# EAGLE design dual_usb (EAGLE 4.16)
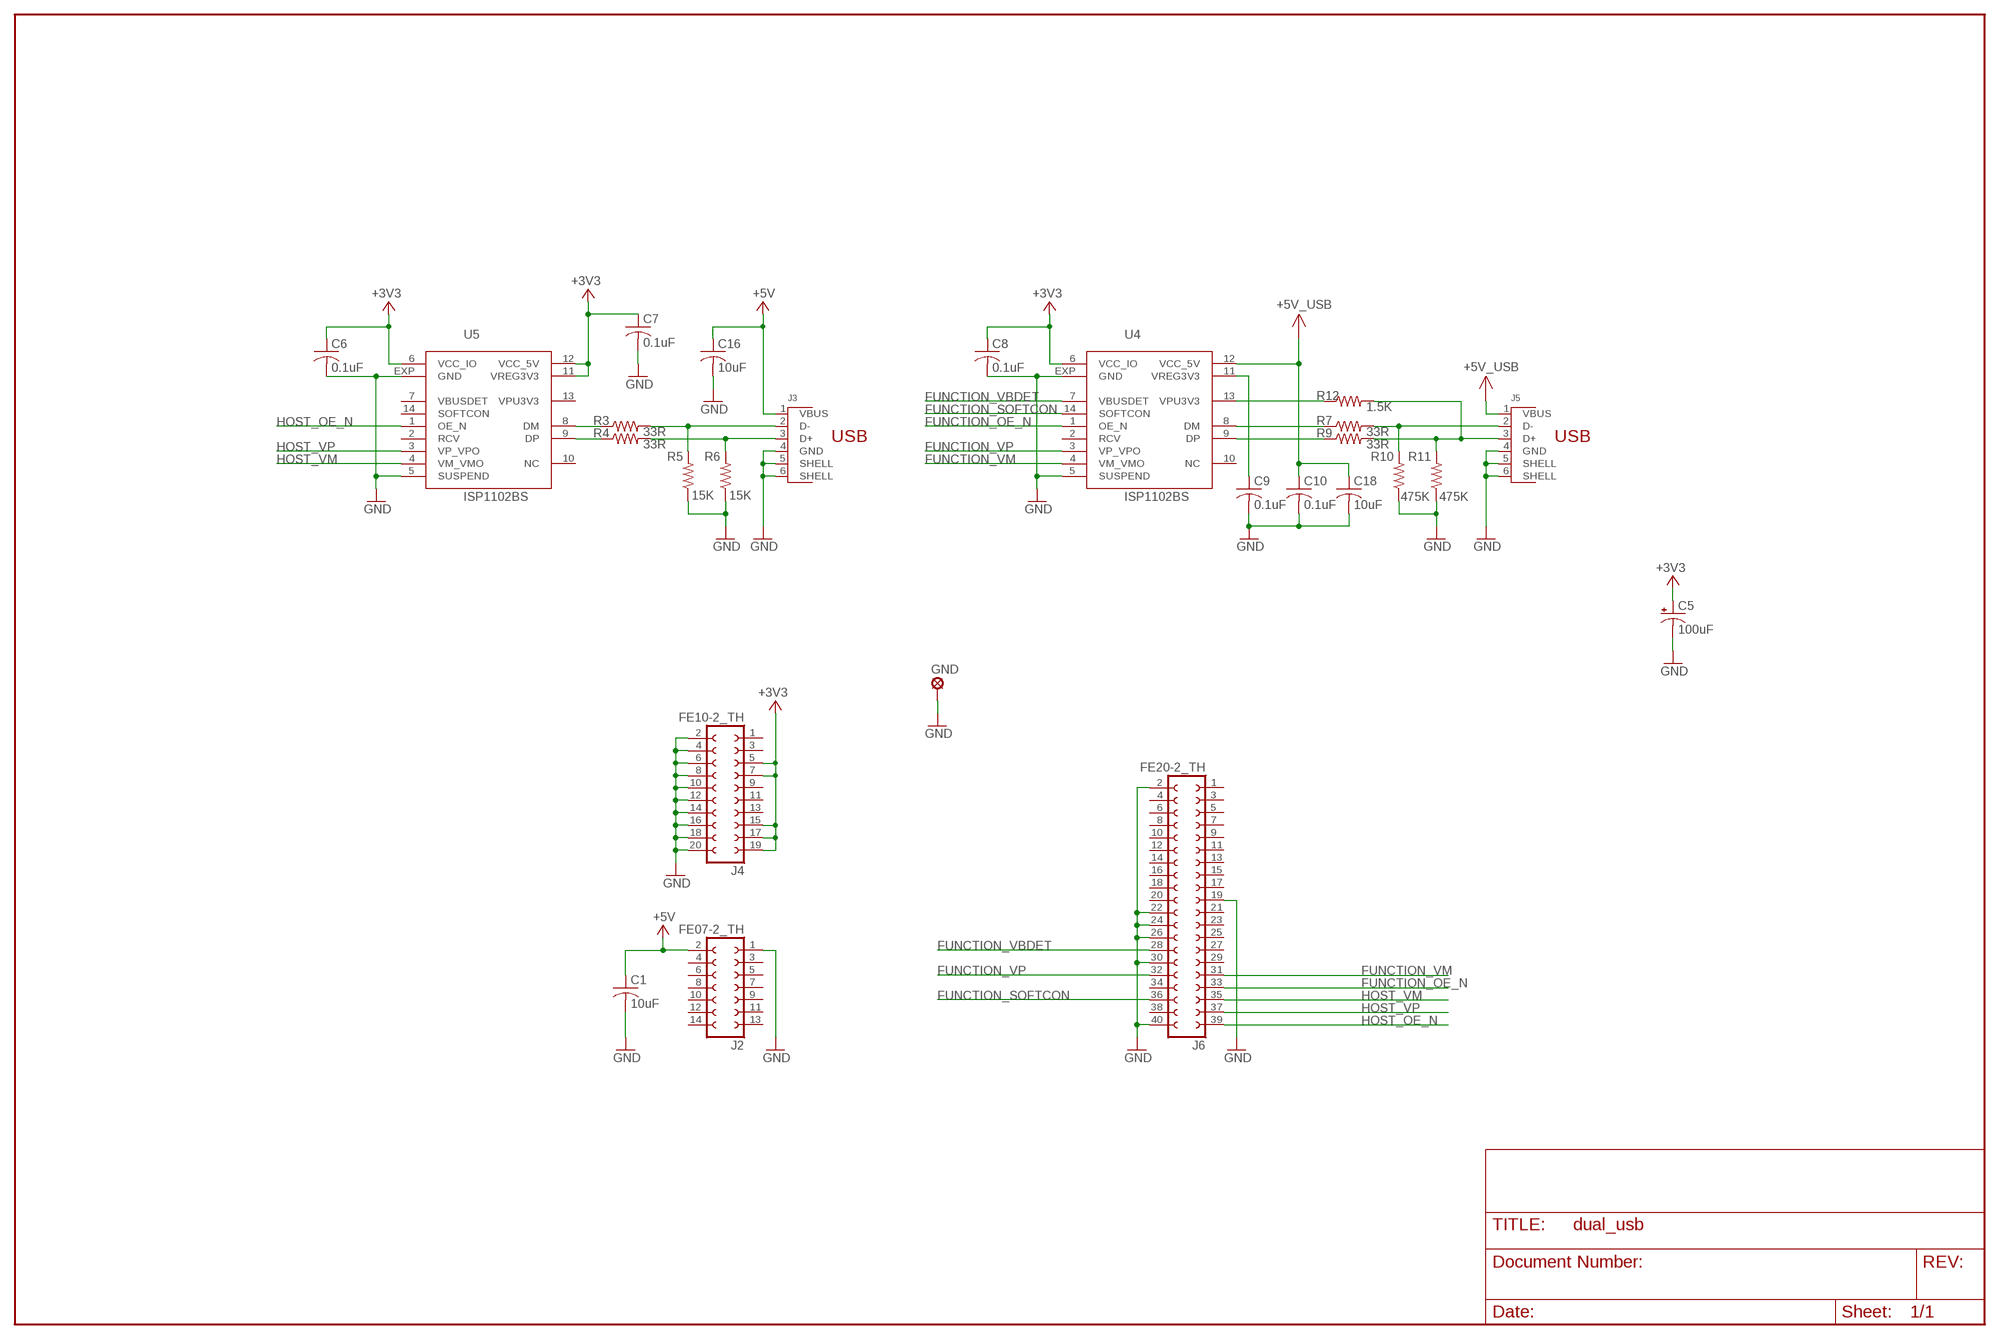
[diagram p0: schematic, sheet 1]

## Parts
C1  10uF  C-USC0603  [C0603]
C5  100uF  CPOL-USCT3528  [CT3528]
C6  0.1uF  C-USC0603  [C0603]
C7  0.1uF  C-USC0603  [C0603]
C8  0.1uF  C-USC0603  [C0603]
C9  0.1uF  C-USC0603  [C0603]
C10  0.1uF  C-USC0603  [C0603]
C16  10uF  C-USC0603  [C0603]
C18  10uF  C-USC0603  [C0603]
GND  LSP10  [LSP10]
J2  FE07-2_TH  [FE07-2_TH]
J3  PN87520  [PN87520]
J4  FE10-2_TH  [FE10-2_TH]
J5  897-43-004-90-000000  [USB-B-PTH]
J6  FE20-2_TH  [FE20-2_TH]
R3  33R  R-US_R0603  [R0603]
R4  33R  R-US_R0603  [R0603]
R5  15K  R-US_R0603  [R0603]
R6  15K  R-US_R0603  [R0603]
R7  33R  R-US_R0603  [R0603]
R9  33R  R-US_R0603  [R0603]
R10  475K  R-US_R0603  [R0603]
R11  475K  R-US_R0603  [R0603]
R12  1.5K  R-US_R0603  [R0603]
U4  ISP1102BS  [HVQFN14]
U5  ISP1102BS  [HVQFN14]

## Nets
+3V3: C5.+ C6.1 C7.1 C8.1 J4.5 J4.7 J4.15 J4.17 J4.19 U4.6(VCC_IO) U5.6(VCC_IO) U5.11(VREG3V3) U5.12(VCC_5V)
+5V: C1.1 C16.1 J2.2 J3.1(VBUS)
+5V_USB: C10.1 C18.1 J5.1(VBUS) U4.12(VCC_5V)
FUNCTION_OE_N: J6.33 U4.1(OE_N)
FUNCTION_SOFTCON: J6.36 U4.14(SOFTCON)
FUNCTION_VBDET: J6.28 U4.7(VBUSDET)
FUNCTION_VM: J6.31 U4.4(VM_VMO)
FUNCTION_VP: J6.32 U4.3(VP_VPO)
GND: C1.2 C5.- C6.2 C7.2 C8.2 C9.2 C10.2 C16.2 C18.2 GND.MP J2.1 J3.4(GND) J3.5(SHELL) J3.6(SHELL) J4.2 J4.4 J4.6 J4.8 J4.10 J4.12 J4.14 J4.16 J4.18 J4.20 J5.4(GND) J5.5(SHELL) J5.6(SHELL) J6.2 J6.19 J6.22 J6.24 J6.26 J6.30 J6.40 R5.1 R6.1 R10.1 R11.1 U4.5(SUSPEND) U4.EXP(GND) U5.5(SUSPEND) U5.EXP(GND)
HOST_OE_N: J6.39 U5.1(OE_N)
HOST_VM: J6.35 U5.4(VM_VMO)
HOST_VP: J6.37 U5.3(VP_VPO)
N$2: R3.1 U5.8(DM)
N$3: R4.1 U5.9(DP)
N$4: R7.1 U4.8(DM)
N$5: J3.2(D-) R3.2 R5.2
N$13: C9.1 U4.11(VREG3V3)
N$14: J3.3(D+) R4.2 R6.2
N$15: R9.1 U4.9(DP)
N$33: J5.2(D-) R7.2 R10.2
N$45: R12.1 U4.13(VPU3V3)
N$46: J5.3(D+) R9.2 R11.2 R12.2
Unconnected: J2.3 J2.4 J2.5 J2.6 J2.7 J2.8 J2.9 J2.10 J2.11 J2.12 J2.13 J2.14 J4.1 J4.3 J4.9 J4.11 J4.13 J6.1 J6.3 J6.4 J6.5 J6.6 J6.7 J6.8 J6.9 J6.10 J6.11 J6.12 J6.13 J6.14 J6.15 J6.16 J6.17 J6.18 J6.20 J6.21 J6.23 J6.25 J6.27 J6.29 J6.34 J6.38 U4.2(RCV) U4.10(NC) U5.2(RCV) U5.7(VBUSDET) U5.10(NC) U5.13(VPU3V3) U5.14(SOFTCON)

## Library data of the parts
C1 C6-C10 C16 C18 = rcl:C-US: CAPACITOR, American symbol
C5 = rcl:CPOL-US: POLARIZED CAPACITOR, American symbol
GND = solpad:LSP10: SOLDER PAD drill 1.0 mm, distributor Buerklin, 12H555
J2 = base2designs:FE07-2_TH
J3 = base2designs:PN87520: BERG USB connector
J4 = base2designs:FE10-2_TH
J5 = base2designs:897-43-004-90-000000
J6 = base2designs:FE20-2_TH
R3-R7 R9-R12 = rcl:R-US_: RESISTOR, American symbol
U4 U5 = base2designs:ISP1102BS

## Board
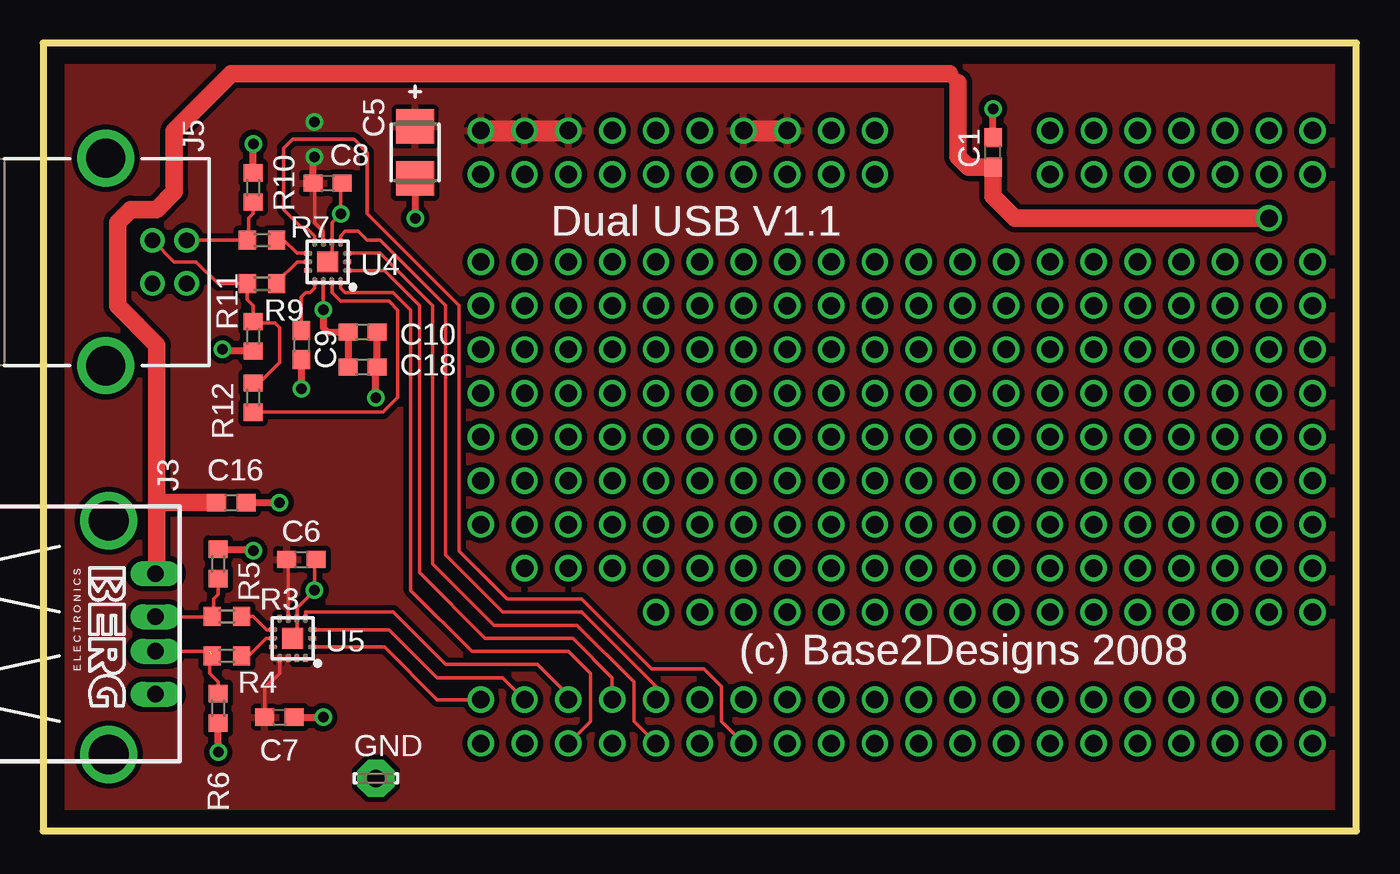
[diagram p1: board, top side]
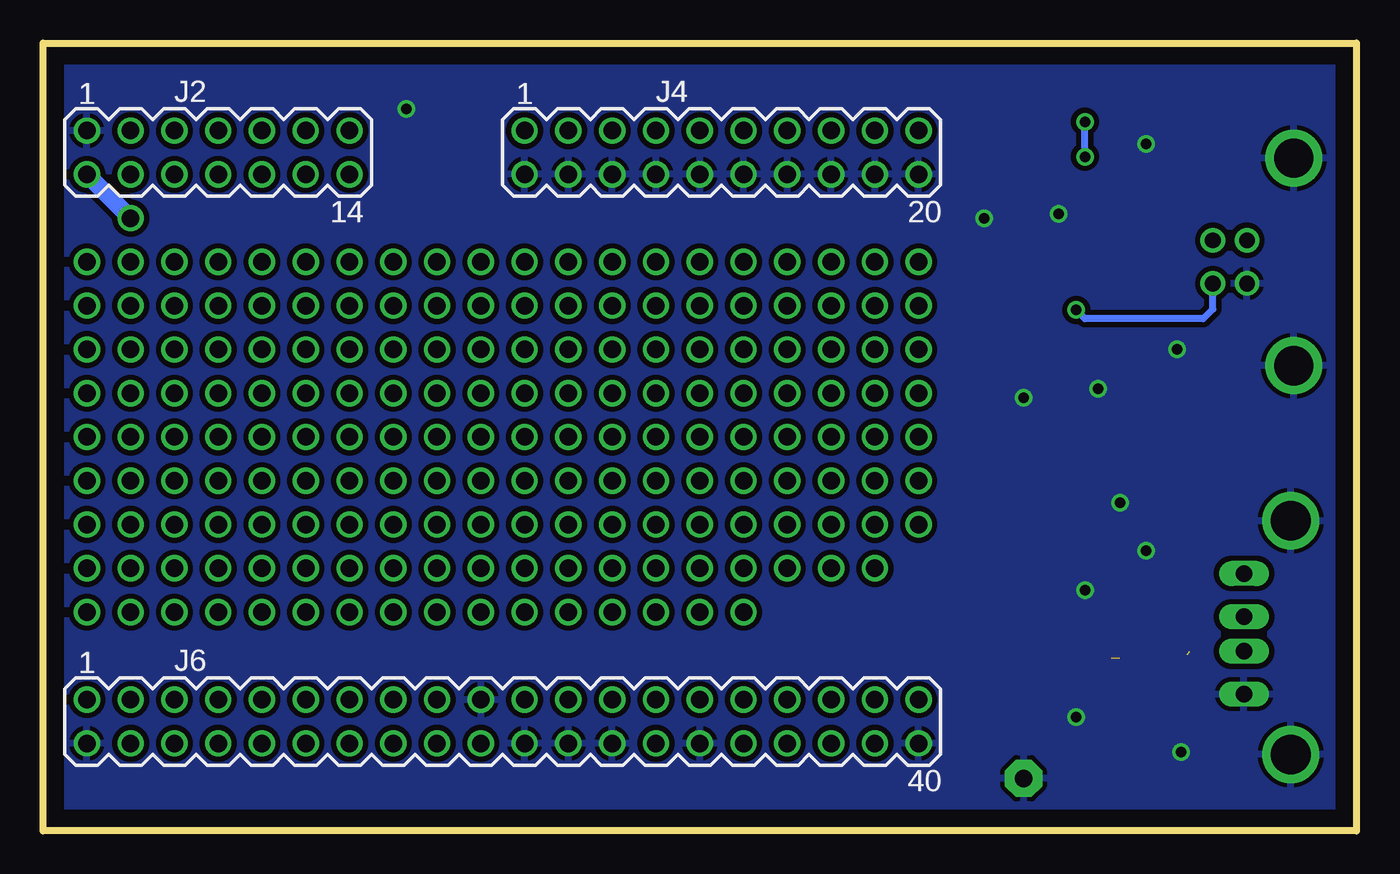
[diagram p2: board, bottom side, seen from below]

Size 76.2 x 45.72 mm. Coordinates in mm from the lower left corner, seen from the top.
Outline: 0,0 76.2,0 76.2,45.72 0,45.72 0,0
Copper layers (1*16): Top 0.035mm / dielectric 1.5mm / Bottom 0.035mm
Design rules "default": minimum track width 8mil, minimum drill 24mil, track to track 8mil, track to pad 8mil, pad to pad 8mil, via to via 8mil, smd to smd 8mil, copper to edge 40mil, drill to drill 8mil, minimum pad ring 10mil, minimum via ring 8mil, stop-mask expansion 3mil, vias tented up to drill 0mil, thermal gap 10mil

### Footprints (pad centres in the part's own frame; a part is rotated, then mirrored left to right if it is on the bottom)
C0603 = smd 1.1 x 1: 1 -0.85,0; 2 0.85,0
CT3528 = smd 2 x 2.2: + 1.5,0; - -1.5,0
LSP10 = drill 1.016 pad 2.159 octagon: MP 0,0
FE07-2_TH = drill 1.016 pad 1.397 round: 1 -7.62,1.27; 2 -7.62,-1.27; 3 -5.08,1.27; 4 -5.08,-1.27; 5 -2.54,1.27; 6 -2.54,-1.27; 7 0,1.27; 8 0,-1.27; 9 2.54,1.27; 10 2.54,-1.27; 11 5.08,1.27; 12 5.08,-1.27; 13 7.62,1.27; 14 7.62,-1.27
PN87520 = drill 0.95 long: 1 -3.5,2.71; 2 -1,2.71; 3 1,2.71; 4 3.5,2.71 | drill 2.3 round: 5 -6.57,0; 6 7,0
FE10-2_TH = drill 1.016 pad 1.397 round: 1 -11.43,1.27; 2 -11.43,-1.27; 3 -8.89,1.27; 4 -8.89,-1.27; 5 -6.35,1.27; 6 -6.35,-1.27; 7 -3.81,1.27; 8 -3.81,-1.27; 9 -1.27,1.27; 10 -1.27,-1.27; 11 1.27,1.27; 12 1.27,-1.27; 13 3.81,1.27; 14 3.81,-1.27; 15 6.35,1.27; 16 6.35,-1.27; 17 8.89,1.27; 18 8.89,-1.27; 19 11.43,1.27; 20 11.43,-1.27
USB-B-PTH = drill 0.914 round: 1 1.25,1.981; 2 -1.25,1.981; 3 -1.25,0; 4 1.25,0 | drill 2.286 round: 5 -6.02,-2.718; 6 6.02,-2.718
FE20-2_TH = drill 1.016 pad 1.397 round: 1 -24.13,1.27; 2 -24.13,-1.27; 3 -21.59,1.27; 4 -21.59,-1.27; 5 -19.05,1.27; 6 -19.05,-1.27; 7 -16.51,1.27; 8 -16.51,-1.27; 9 -13.97,1.27; 10 -13.97,-1.27; 11 -11.43,1.27; 12 -11.43,-1.27; 13 -8.89,1.27; 14 -8.89,-1.27; 15 -6.35,1.27; 16 -6.35,-1.27; 17 -3.81,1.27; 18 -3.81,-1.27; 19 -1.27,1.27; 20 -1.27,-1.27; 21 1.27,1.27; 22 1.27,-1.27; 23 3.81,1.27; 24 3.81,-1.27; 25 6.35,1.27; 26 6.35,-1.27; 27 8.89,1.27; 28 8.89,-1.27; 29 11.43,1.27; 30 11.43,-1.27; 31 13.97,1.27; 32 13.97,-1.27; 33 16.51,1.27; 34 16.51,-1.27; 35 19.05,1.27; 36 19.05,-1.27; 37 21.59,1.27; 38 21.59,-1.27; 39 24.13,1.27; 40 24.13,-1.27
R0603 = smd 1 x 1.1: 1 -0.85,0; 2 0.85,0
HVQFN14 = smd 0.4 x 0.254: 1 -1.175,0.5; 2 -1.175,0; 3 -1.175,-0.5; 8 1.153,-0.5; 9 1.153,0; 10 1.153,0.5 | smd 0.254 x 0.4: 4 -0.75,-1.16; 5 -0.25,-1.16; 6 0.25,-1.16; 7 0.75,-1.16; 11 0.75,1.153; 12 0.25,1.153; 13 -0.25,1.153; 14 -0.75,1.153 | smd 1.2 x 1.2: EXP 0,0

### Placement (x,y rotation side)
C1  55.12,39.37 90 top
C5  21.59,39.37 90 top
C6  14.99,15.75 0 top
C7  13.72,6.6 0 top
C8  16.51,37.59 0 top
C9  14.99,28.19 270 top
C10  18.54,28.96 0 top
C16  10.92,19.05 0 top
C18  18.54,26.92 0 top
GND  19.3,3.05 0 top
J2  66.04,39.37 0 bottom
J3  3.81,11.43 270 top
J4  36.83,39.37 0 bottom
J5  6.35,33.02 270 top
J6  49.53,6.35 0 bottom
R3  10.67,12.45 180 top
R4  10.67,10.16 180 top
R5  10.16,15.49 270 top
R6  10.16,7.11 90 top
R7  12.7,34.29 180 top
R9  12.7,31.75 180 top
R10  12.19,37.34 270 top
R11  12.19,28.7 90 top
R12  12.19,25.15 90 top
U4  16.51,33.02 180 top
U5  14.48,11.18 180 top

### Tracks (layer width: path | path; a pad name or v marks a point on that pad's centre or on a via)
+3V3  (via drill 0.61)  (1 unrouted)
  Top 0.203: C7.1 12.87,8.29 13.72,9.14 13.72,10.16 13.73,10.15 U5.11 | C6.1 14.22,15.75 14.23,15.74 U5.6 | U4.6 16.26,34.79 15.75,35.31 15.75,37.34 15.49,37.59 C8.1
  Top 0.406: C8.1 15.66,39.28 v15.75,39.12
  Top 1.219: J4.7 J4.5 | J4.19 J4.17 J4.15
  Bottom 0.406: v15.75,39.12 v15.75,41.15
  pour Top (isolate 0.305): 0,45.72 76.2,45.72 76.2,0 0,0
+5V  (via drill 1.02)
  Top 0.813: 6.6,14.99 6.55,14.93 J3.1 | 52.58,43.94 53.09,43.43 | C1.1 55.12,38.61
  Top 1.016: 6.6,14.99 6.6,19.05 | 6.6,19.05 6.6,28.19 4.32,30.48 4.32,35.31 5.08,36.07 6.6,36.07 7.62,37.08 7.62,40.64 10.92,43.94 52.58,43.94 | 6.6,19.05 C16.1 | 53.09,43.43 53.09,39.12 53.68,38.52 C1.1 55.12,36.83 56.39,35.56 v71.12,35.56
  Bottom 1.016: v71.12,35.56 J2.2
+5V_USB  (via drill 0.61)
  Top 0.203: U4.12 v16.26,30.23
  Top 0.406: v16.26,30.23 16.26,29.21 16.51,28.96 17.53,28.96 | 17.78,28.96 C10.1 17.53,28.96 | C18.1 17.69,28.79 17.53,28.96
  Bottom 0.406: J5.1 8.33,30.28 8.89,29.72 15.75,29.72 v16.26,30.23
FUNCTION_OE_N
  Top 0.203: J6.33 33.02,8.89 30.73,11.18 25.65,11.18 21.84,14.99 21.84,30.48 19.81,32.51 17.78,32.51 17.77,32.52 U4.1
FUNCTION_SOFTCON
  Top 0.203: J6.36 31.75,6.35 31.75,9.14 30.48,10.41 24.89,10.41 21.34,13.97 21.34,30.23 20.32,31.24 17.53,31.24 17.26,31.51 U4.14
FUNCTION_VBDET
  Top 0.203: J6.28 39.37,6.35 39.37,8.38 38.35,9.4 35.31,9.4 31.24,13.46 26.92,13.46 24.13,16.26 24.13,30.48 18.8,35.81 18.8,39.37 18.03,40.13 14.48,40.13 13.97,39.62 13.97,36.07 14.99,35.05 15.24,35.05 15.76,34.53 U4.7
FUNCTION_VM
  Top 0.203: J6.31 35.56,8.38 31.24,12.7 26.67,12.7 23.37,16 23.37,30.48 19.56,34.29 18.8,34.29 18.29,34.8 17.53,34.8 17.26,34.53 U4.4
FUNCTION_VP
  Top 0.203: J6.32 34.29,6.35 34.29,8.64 30.99,11.94 26.16,11.94 22.61,15.49 22.61,30.48 19.56,33.53 17.53,33.53 17.53,33.52 U4.3 17.77,33.52 17.78,33.53
GND  (via drill 0.61)
  Top 0.203: U5.EXP 14.73,11.43 U5.5 14.73,12.95 v15.75,13.97 15.75,15.75 C6.2 | U4.EXP 16.76,33.27 U4.5 16.76,35.3 v17.27,35.81 17.27,37.34 17.53,37.59 C8.2
  Top 0.406: C7.2 v16.26,6.6 | v10.16,4.57 R6.1 | R5.1 12.1,16.34 v12.19,16.26 | C16.2 v13.72,19.05 | R10.1 v12.19,39.88 | R11.1 10.5,27.85 v10.41,27.94 | C5.- v21.59,35.56 | C1.2 v55.12,41.91 | 19.3,26.92 C18.2 | C10.2 19.39,27.01 19.3,26.92 | v19.3,25.15 19.3,26.92 | C9.2 v14.99,25.65
  pour Bottom (isolate 0.305): 0,45.72 76.2,45.72 76.2,0 0,0
HOST_OE_N
  Top 0.203: U5.1 19.8,10.68 22.86,7.62 J6.39
HOST_VM
  Top 0.203: U5.4 15.23,12.69 15.24,12.7 20.32,12.7 23.37,9.65 28.7,9.65 30.73,7.62 J6.35
HOST_VP
  Top 0.203: U5.3 20.07,11.68 22.86,8.89 26.67,8.89 J6.37
N$2
  Top 0.203: U5.8 12.96,11.68 12.19,12.45 R3.1
N$3
  Top 0.203: U5.9 12.95,11.18 11.94,10.16 R4.1
N$4
  Top 0.203: R7.1 13.97,34.29 14.73,33.53 15.49,33.53 15.49,33.52 U4.8
N$5
  Top 0.203: J3.2 9.89,12.43 9.91,12.45 | R5.2 10.16,13.72 9.91,13.46 9.91,12.45 | 9.91,12.45 R3.2
N$6  (via drill 1.02)
  other vias: 73.66,33.02
N$7  (via drill 1.02)
  other vias: 73.66,30.48
N$8  (via drill 1.02)
  other vias: 73.66,27.94
N$9  (via drill 1.02)
  other vias: 73.66,25.4
N$11  (via drill 1.02)
  other vias: 73.66,22.86
N$12  (via drill 1.02)
  other vias: 73.66,20.32
N$13
  Top 0.203: U4.11 15.76,31.51 15.49,31.24 15.24,31.24 14.99,30.99 C9.1 14.99,28.96
N$14  (1 unrouted)
  Top 0.203: J3.3 9.38,10.43 9.65,10.16 R4.2 9.82,10.25 | R6.2 10.16,8.64 9.65,9.14 9.65,10.41
N$15
  Top 0.203: R9.1 13.55,31.84 14.73,33.02 U4.9 15.49,33.02
N$16  (via drill 1.02)
  other vias: 73.66,17.78
N$17  (via drill 1.02)
  other vias: 73.66,15.24
N$18  (via drill 1.02)
  other vias: 73.66,12.7
N$19  (via drill 1.02)
  other vias: 71.12,12.7
N$20  (via drill 1.02)
  other vias: 71.12,15.24
N$21  (via drill 1.02)
  other vias: 71.12,17.78
N$22  (via drill 1.02)
  other vias: 71.12,20.32
N$23  (via drill 1.02)
  other vias: 71.12,22.86
N$24  (via drill 1.02)
  other vias: 71.12,25.4
N$25  (via drill 1.02)
  other vias: 71.12,27.94
N$26  (via drill 1.02)
  other vias: 71.12,30.48
N$27  (via drill 1.02)
  other vias: 71.12,33.02
N$28  (via drill 1.02)
  other vias: 68.58,33.02
N$29  (via drill 1.02)
  other vias: 68.58,30.48
N$30  (via drill 1.02)
  other vias: 68.58,27.94
N$31  (via drill 1.02)
  other vias: 68.58,25.4
N$32  (via drill 1.02)
  other vias: 68.58,22.86
N$33
  Top 0.203: J5.2 8.38,34.27 8.38,34.29 R7.2 11.94,34.29 11.94,35.56 12.19,35.81 R10.2
N$34  (via drill 1.02)
  other vias: 68.58,20.32
N$35  (via drill 1.02)
  other vias: 68.58,17.78
N$36  (via drill 1.02)
  other vias: 68.58,15.24
N$37  (via drill 1.02)
  other vias: 68.58,12.7
N$38  (via drill 1.02)
  other vias: 66.04,12.7
N$39  (via drill 1.02)
  other vias: 66.04,15.24
N$40  (via drill 1.02)
  other vias: 66.04,17.78
N$41  (via drill 1.02)
  other vias: 66.04,20.32
N$42  (via drill 1.02)
  other vias: 66.04,22.86
N$43  (via drill 1.02)
  other vias: 66.04,25.4
N$44  (via drill 1.02)
  other vias: 66.04,27.94
N$45
  Top 0.203: R12.1 19.72,24.3 20.57,25.15 20.57,30.23 20.07,30.73 17.27,30.73 16.76,31.24 16.76,32 U4.13
N$46
  Top 0.203: J5.3 6.35,34.29 7.62,33.02 8.89,33.02 10.16,31.75 R9.2 11.85,30.82 12.19,30.48 R11.2 12.19,29.46 13.46,29.46 13.72,29.21 13.72,27.18 12.53,26 R12.2
N$47  (via drill 1.02)
  other vias: 66.04,30.48
N$48  (via drill 1.02)
  other vias: 66.04,33.02
N$49  (via drill 1.02)
  other vias: 63.5,33.02
N$50  (via drill 1.02)
  other vias: 63.5,30.48
N$51  (via drill 1.02)
  other vias: 63.5,27.94
N$52  (via drill 1.02)
  other vias: 63.5,25.4
N$53  (via drill 1.02)
  other vias: 63.5,22.86
N$54  (via drill 1.02)
  other vias: 63.5,20.32
N$55  (via drill 1.02)
  other vias: 63.5,17.78
N$56  (via drill 1.02)
  other vias: 63.5,15.24
N$57  (via drill 1.02)
  other vias: 63.5,12.7
N$59  (via drill 1.02)
  other vias: 60.96,33.02
N$60  (via drill 1.02)
  other vias: 60.96,30.48
N$61  (via drill 1.02)
  other vias: 60.96,27.94
N$62  (via drill 1.02)
  other vias: 60.96,25.4
N$63  (via drill 1.02)
  other vias: 60.96,22.86
N$64  (via drill 1.02)
  other vias: 60.96,20.32
N$65  (via drill 1.02)
  other vias: 60.96,17.78
N$66  (via drill 1.02)
  other vias: 60.96,15.24
N$67  (via drill 1.02)
  other vias: 60.96,12.7
N$68  (via drill 1.02)
  other vias: 58.42,12.7
N$69  (via drill 1.02)
  other vias: 58.42,15.24
N$70  (via drill 1.02)
  other vias: 58.42,17.78
N$71  (via drill 1.02)
  other vias: 58.42,20.32
N$72  (via drill 1.02)
  other vias: 58.42,22.86
N$73  (via drill 1.02)
  other vias: 58.42,25.4
N$74  (via drill 1.02)
  other vias: 58.42,27.94
N$75  (via drill 1.02)
  other vias: 58.42,30.48
N$76  (via drill 1.02)
  other vias: 58.42,33.02
N$77  (via drill 1.02)
  other vias: 55.88,33.02
N$78  (via drill 1.02)
  other vias: 55.88,30.48
N$79  (via drill 1.02)
  other vias: 55.88,27.94
N$80  (via drill 1.02)
  other vias: 55.88,25.4
N$81  (via drill 1.02)
  other vias: 55.88,22.86
N$82  (via drill 1.02)
  other vias: 55.88,20.32
N$83  (via drill 1.02)
  other vias: 55.88,17.78
N$84  (via drill 1.02)
  other vias: 55.88,15.24
N$85  (via drill 1.02)
  other vias: 55.88,12.7
N$86  (via drill 1.02)
  other vias: 53.34,12.7
N$87  (via drill 1.02)
  other vias: 53.34,15.24
N$88  (via drill 1.02)
  other vias: 53.34,17.78
N$89  (via drill 1.02)
  other vias: 53.34,20.32
N$90  (via drill 1.02)
  other vias: 53.34,22.86
N$91  (via drill 1.02)
  other vias: 53.34,25.4
N$92  (via drill 1.02)
  other vias: 53.34,27.94
N$93  (via drill 1.02)
  other vias: 53.34,30.48
N$94  (via drill 1.02)
  other vias: 53.34,33.02
N$95  (via drill 1.02)
  other vias: 50.8,33.02
N$96  (via drill 1.02)
  other vias: 50.8,30.48
N$97  (via drill 1.02)
  other vias: 50.8,27.94
N$98  (via drill 1.02)
  other vias: 50.8,25.4
N$99  (via drill 1.02)
  other vias: 50.8,22.86
N$100  (via drill 1.02)
  other vias: 50.8,20.32
N$101  (via drill 1.02)
  other vias: 50.8,17.78
N$102  (via drill 1.02)
  other vias: 50.8,15.24
N$103  (via drill 1.02)
  other vias: 50.8,12.7
N$105  (via drill 1.02)
  other vias: 48.26,33.02
N$106  (via drill 1.02)
  other vias: 48.26,30.48
N$107  (via drill 1.02)
  other vias: 48.26,27.94
N$108  (via drill 1.02)
  other vias: 48.26,25.4
N$109  (via drill 1.02)
  other vias: 48.26,22.86
N$110  (via drill 1.02)
  other vias: 48.26,20.32
N$111  (via drill 1.02)
  other vias: 48.26,17.78
N$112  (via drill 1.02)
  other vias: 48.26,15.24
N$113  (via drill 1.02)
  other vias: 48.26,12.7
N$114  (via drill 1.02)
  other vias: 45.72,12.7
N$115  (via drill 1.02)
  other vias: 45.72,15.24
N$116  (via drill 1.02)
  other vias: 45.72,17.78
N$117  (via drill 1.02)
  other vias: 45.72,20.32
N$118  (via drill 1.02)
  other vias: 45.72,22.86
N$119  (via drill 1.02)
  other vias: 45.72,25.4
N$120  (via drill 1.02)
  other vias: 45.72,27.94
N$121  (via drill 1.02)
  other vias: 45.72,30.48
N$122  (via drill 1.02)
  other vias: 45.72,33.02
N$123  (via drill 1.02)
  other vias: 43.18,33.02
N$124  (via drill 1.02)
  other vias: 43.18,30.48
N$125  (via drill 1.02)
  other vias: 43.18,27.94
N$126  (via drill 1.02)
  other vias: 43.18,25.4
N$127  (via drill 1.02)
  other vias: 43.18,22.86
N$128  (via drill 1.02)
  other vias: 43.18,20.32
N$129  (via drill 1.02)
  other vias: 43.18,17.78
N$130  (via drill 1.02)
  other vias: 43.18,15.24
N$131  (via drill 1.02)
  other vias: 43.18,12.7
N$132  (via drill 1.02)
  other vias: 40.64,12.7
N$133  (via drill 1.02)
  other vias: 40.64,15.24
N$134  (via drill 1.02)
  other vias: 40.64,17.78
N$135  (via drill 1.02)
  other vias: 40.64,20.32
N$136  (via drill 1.02)
  other vias: 40.64,22.86
N$137  (via drill 1.02)
  other vias: 40.64,25.4
N$138  (via drill 1.02)
  other vias: 40.64,27.94
N$139  (via drill 1.02)
  other vias: 40.64,30.48
N$140  (via drill 1.02)
  other vias: 40.64,33.02
N$141  (via drill 1.02)
  other vias: 38.1,33.02
N$142  (via drill 1.02)
  other vias: 38.1,30.48
N$143  (via drill 1.02)
  other vias: 38.1,27.94
N$144  (via drill 1.02)
  other vias: 38.1,25.4
N$145  (via drill 1.02)
  other vias: 38.1,22.86
N$146  (via drill 1.02)
  other vias: 38.1,20.32
N$147  (via drill 1.02)
  other vias: 38.1,17.78
N$148  (via drill 1.02)
  other vias: 38.1,15.24
N$149  (via drill 1.02)
  other vias: 38.1,12.7
N$151  (via drill 1.02)
  other vias: 35.56,33.02
N$152  (via drill 1.02)
  other vias: 35.56,30.48
N$153  (via drill 1.02)
  other vias: 35.56,27.94
N$154  (via drill 1.02)
  other vias: 35.56,25.4
N$155  (via drill 1.02)
  other vias: 35.56,22.86
N$156  (via drill 1.02)
  other vias: 35.56,20.32
N$157  (via drill 1.02)
  other vias: 35.56,17.78
N$158  (via drill 1.02)
  other vias: 35.56,15.24
N$159  (via drill 1.02)
  other vias: 35.56,12.7
N$161  (via drill 1.02)
  other vias: 33.02,15.24
N$162  (via drill 1.02)
  other vias: 33.02,17.78
N$163  (via drill 1.02)
  other vias: 33.02,20.32
N$164  (via drill 1.02)
  other vias: 33.02,22.86
N$165  (via drill 1.02)
  other vias: 33.02,25.4
N$166  (via drill 1.02)
  other vias: 33.02,27.94
N$167  (via drill 1.02)
  other vias: 33.02,30.48
N$168  (via drill 1.02)
  other vias: 33.02,33.02
N$169  (via drill 1.02)
  other vias: 30.48,33.02
N$170  (via drill 1.02)
  other vias: 30.48,30.48
N$171  (via drill 1.02)
  other vias: 30.48,27.94
N$172  (via drill 1.02)
  other vias: 30.48,25.4
N$173  (via drill 1.02)
  other vias: 30.48,22.86
N$174  (via drill 1.02)
  other vias: 30.48,20.32
N$175  (via drill 1.02)
  other vias: 30.48,17.78
N$176  (via drill 1.02)
  other vias: 30.48,15.24
N$179  (via drill 1.02)
  other vias: 27.94,15.24
N$180  (via drill 1.02)
  other vias: 27.94,17.78
N$181  (via drill 1.02)
  other vias: 27.94,20.32
N$182  (via drill 1.02)
  other vias: 27.94,22.86
N$183  (via drill 1.02)
  other vias: 27.94,25.4
N$184  (via drill 1.02)
  other vias: 27.94,27.94
N$185  (via drill 1.02)
  other vias: 27.94,30.48
N$186  (via drill 1.02)
  other vias: 27.94,33.02
N$187  (via drill 1.02)
  other vias: 25.4,33.02
N$188  (via drill 1.02)
  other vias: 25.4,30.48
N$189  (via drill 1.02)
  other vias: 25.4,27.94
N$190  (via drill 1.02)
  other vias: 25.4,25.4
N$191  (via drill 1.02)
  other vias: 25.4,22.86
N$192  (via drill 1.02)
  other vias: 25.4,20.32
N$193  (via drill 1.02)
  other vias: 25.4,17.78

### Text on the board
tPlace: Dual USB V1.1 | (c) Base2Designs 2008
_tsilk: C5 | J5 | R10 | C8 | C1 | R7 | Dual USB V1.1 | U4 | R9 | R11 | C9 | C10 | C18 | R12 | J3 | C16 | C6 | R5 | E L E C T R O N I C S | R3 | U5 | (c) Base2Designs 2008 | R4 | C7 | GND | R6
_bsilk: J4 | 1 | J2 | 1 | 20 | 14 | J6 | 1 | 40